# EasyEDA Pro project STC15W4K56S4_2025-01-08_21-36-35.eprj, schematic Schematic1
Board Name: Board1; Create Date: 2025-01-08; Page Name: P1; Project Name: STC15W4K56S4_2025-01-08_21-36-35; Schematic Name: Schematic1; Update Date: 2025-01-13; Company: 嘉立创EDA; Page Size: A3; Version: V1.0
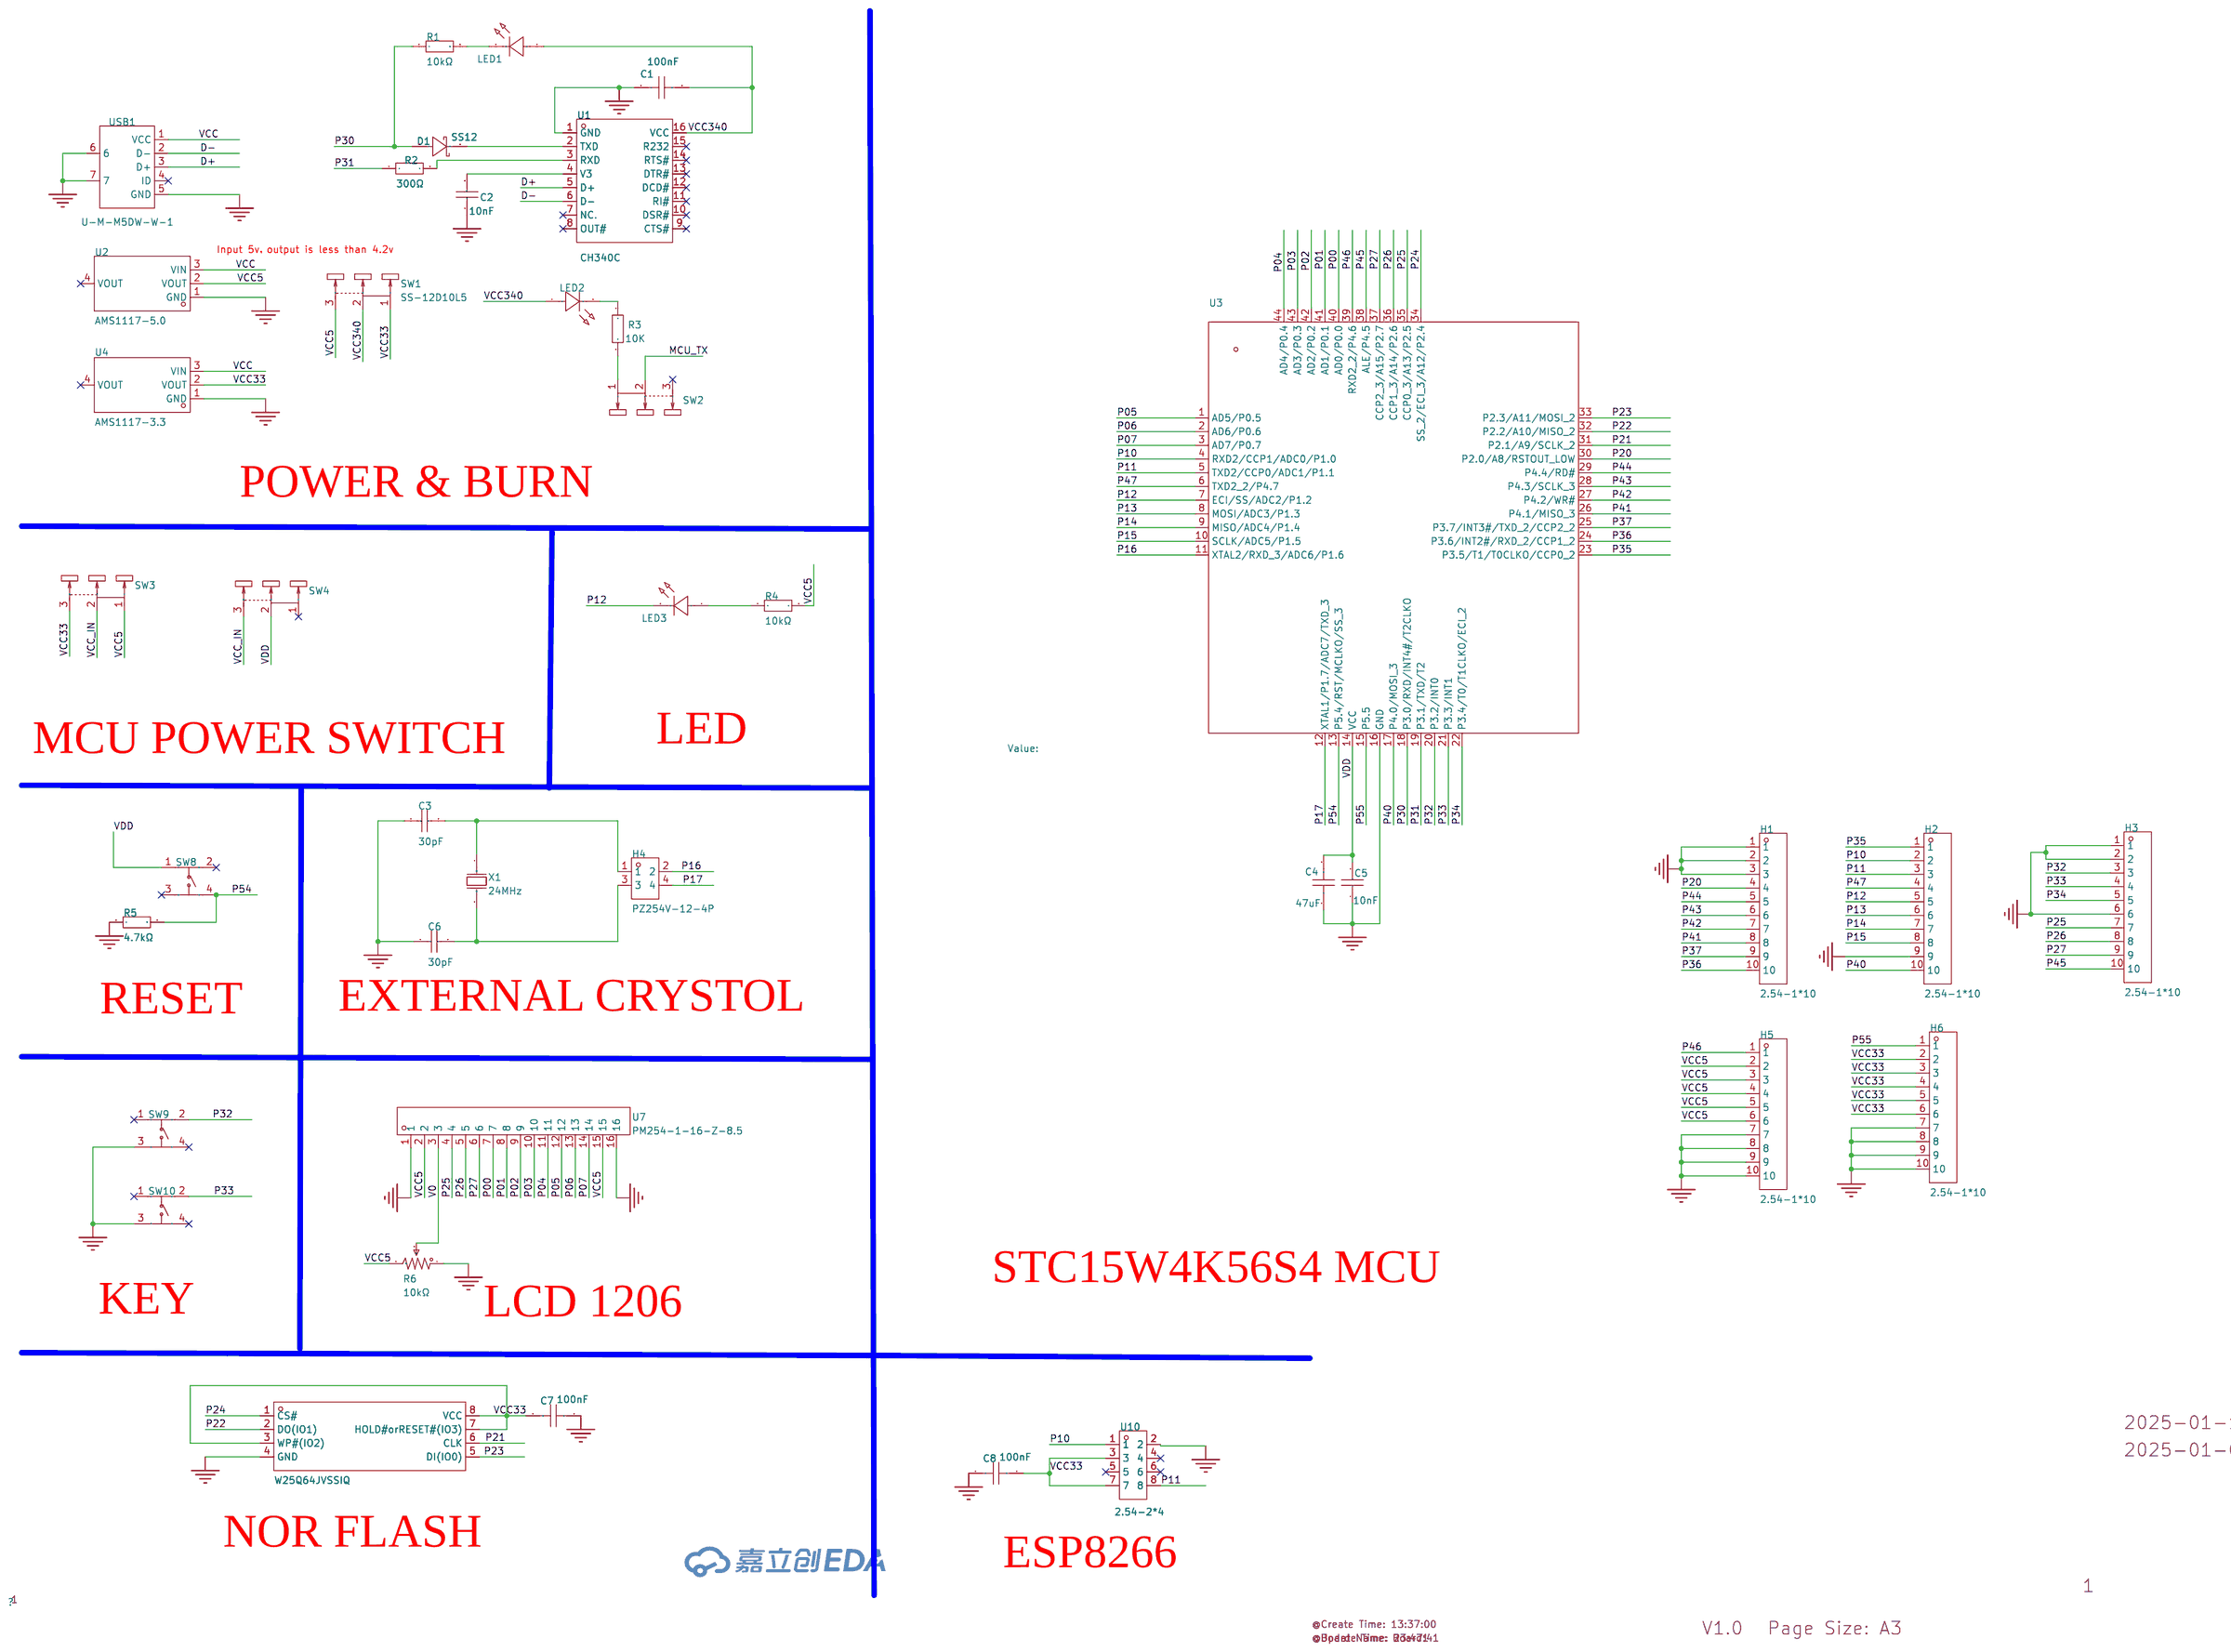
[diagram p0: schematic sheet]

## Parts
C1  100nF  [C0805]
C2  10nF  [C0805]
C3  30pF  [C0805]
C4  47uF  [C0805]
C5  10nF  [C0805]
C6  30pF  [C0805]
C7  100nF  [C0805]
C8  100nF  [C0805]
D1  SS12  [SMA_L4.3-W2.6-LS5.0-RD]
H1  2.54-1*10  [HDR-TH_10P-P2.54-V-M]
H2  2.54-1*10  [HDR-TH_10P-P2.54-V-M]
H3  2.54-1*10  [HDR-TH_10P-P2.54-V-M]
H4  PZ254V-12-4P  [HDR-TH_4P-P2.54-V-M-R2-C2-S2.54]
H5  2.54-1*10  [HDR-TH_10P-P2.54-V-M]
H6  2.54-1*10  [HDR-TH_10P-P2.54-V-M]
LED1  XL-3216SURC  [LED1206-R-RD_RED]
LED2  XL-3216SURC  [LED1206-R-RD_RED]
LED3  XL-3216SURC  [LED1206-R-RD_RED]
R1  10kΩ  [R0805]
R2  300Ω  [R0805]
R3  10K  [R0805]
R4  10kΩ  [R0805]
R5  4.7kΩ  [R0805]
R6  10kΩ  [RES-ADJ-TH_3P-L7.1-W6.9-P2.50-BL-BS]
SW1  SS-12D10L5  [SW-TH_SS-12D10L5]
SW2  SS-12D10L5  [SW-TH_SS-12D10L5]
SW3  SS-12D10L5  [SW-TH_SS-12D10L5]
SW4  SS-12D10L5  [SW-TH_SS-12D10L5]
SW8  KH-6X6X6H-STM  [SW-SMD_4P-L6.0-W6.0-P4.50-LS9.0-3]
SW9  KH-6X6X6H-STM  [SW-SMD_4P-L6.0-W6.0-P4.50-LS9.0-3]
SW10  KH-6X6X6H-STM  [SW-SMD_4P-L6.0-W6.0-P4.50-LS9.0-3]
U1  CH340C  [SOP-16_L10.0-W3.9-P1.27-LS6.0-BL]
U2  AMS1117-5.0  [SOT-223_L6.5-W3.5-P2.30-LS7.0-BR]
U3  STC15W4K56S4-30I-LQFP44  [LQFP-44_L10.0-W10.0-P0.80-LS12.0-BL]
U4  AMS1117-3.3  [SOT-223-3_L6.5-W3.4-P2.30-LS7.0-BR]
U7  PM254-1-16-Z-8.5  [HDR-TH_16P-P2.54-V-F-A]
U9  W25Q64JVSSIQ  [SOIC-8_L5.3-W5.3-P1.27-LS8.0-BL]
U10  2.54-2*4  [HDR-TH_8P-P2.54-V-F-R2-C4-S2.54]
USB1  U-M-M5DW-W-1  [MINI-USB-TH_U-M-M5DW-W-1]
X1  24MHz  [HC-49US_L11.5-W4.5-P4.88]

## Library data of the parts
C1 C7 C8 = CC0805KRX7R9BB104: LCSC Part Name: 100nF ±10% 50V; Supplier Part: C49678; Manufacturer: YAGEO(国巨); Supplier Footprint: 0805; JLCPCB Part Class: 基础库; Datasheet: https://atta.szlcsc.com/upload/public/pdf/source/20180224/C181747_15194369449651363981.pdf; Supplier: LCSC; Tolerance: ±10%; Voltage Rated: 50V; Temperature Coefficient: X7R
C2 C5 = CL21B103KBANNNC: LCSC Part Name: 10nF ±10% 50V; Supplier Part: C1710; Manufacturer: SAMSUNG(三星); Supplier Footprint: 0805; JLCPCB Part Class: 基础库; Datasheet: https://atta.szlcsc.com/upload/public/pdf/source/20160218/1457707763339.pdf; Supplier: LCSC; Tolerance: ±10%; Voltage Rated: 50V; Temperature Coefficient: X7R
C3 C6 = CC0805JRNPO9BN300: LCSC Part Name: 30pF ±5% 50V; Supplier Part: C107114; Manufacturer: YAGEO(国巨); Supplier Footprint: 0805; JLCPCB Part Class: 扩展库; Datasheet: https://atta.szlcsc.com/upload/public/pdf/source/20170914/C128857_1505359892143968080.pdf; Supplier: LCSC; Tolerance: ±5%; Voltage Rated: 50V; Temperature Coefficient: NP0
C4 = CGA0805X5R476M100MT: LCSC Part Name: 47uF ±20% 10V; Supplier Part: C6119904; Manufacturer: HRE(芯声); Supplier Footprint: 0805; JLCPCB Part Class: 扩展库; Supplier: LCSC; Tolerance: ±20%; Voltage Rated: 10V; Temperature Coefficient: X5R
D1 = SS12_C18199177: LCSC Part Name: 电压:20V 电流:1A; Supplier Part: C18199177; Manufacturer: 宏迦橙; Supplier Footprint: SMA(DO-214AC); JLCPCB Part Class: 扩展库; Datasheet: https://atta.szlcsc.com/upload/public/pdf/source/20230828/C73881E3299A0827586C2B1C18B17A53.pdf; Supplier: LCSC; Diode Configuration: 独立式; Forward Voltage (Vf@If): 550mV@1.0A; Reverse Voltage (Vr): 20V; Rectified Current: 1A; Reverse Leakage Current (Ir): 200uA@20V
H1-H3 H5 H6 = 2.54-1*10: Supplier Part: C5156617; Manufacturer: ZHOURI(洲日); Supplier Footprint: 插件,P=2.54mm; JLCPCB Part Class: 扩展库; Datasheet: https://atta.szlcsc.com/upload/public/pdf/source/20220915/6A37F92D15B6B0AD6F0538B20A260D3B.pdf; Supplier: LCSC; Pin Structure: 1x10P; Pitch: 2.54mm; Number of Rows: 单排; Number of Pins: 10P
H4 = PZ254V-12-4P: LCSC Part Name: 间距:2.54mm 2x2P 直插 方针; Supplier Part: C492419; Manufacturer: XFCN(兴飞); Supplier Footprint: 插件,P=2.54mm; JLCPCB Part Class: 扩展库; Datasheet: https://atta.szlcsc.com/upload/public/pdf/source/20200309/C492419_0001C06E73AFF21BD0ED3D7CEEF46D29.pdf; Supplier: LCSC; Pin Structure: 2x2P; Pitch: 2.54mm; Row Spacing: 2.54mm; Circluar Pins/Square Pins: 方针; Mounting Type: 直插; Number of Rows: 双排; Number of Pins: 4P; Length of Mating Pin: 6mm; Insulation Height: 2.5mm; Length of End Connection Pin: 3mm; Contact Material: 黄铜; Operating Temperature Range: -40℃~+105℃; Color: 黑色
LED1-LED3 = XL-3216SURC: Supplier Part: C965822; Manufacturer: XINGLIGHT(成兴光); Supplier Footprint: 1206; JLCPCB Part Class: 扩展库; Datasheet: https://atta.szlcsc.com/upload/public/pdf/source/20221102/38B682A5E5FDBBFCA7077B6272CE8E6F.pdf; Supplier: LCSC; Emitted Color: 红色; Power Dissipation: 55mW; Forward Current: 25mA; Dominant Wavelength: 617nm~621nm; Peak Wavelength: 623nm; Lens Color: 无色透明透镜; Viewing Angle: 120°; Mounting Sytle: 正贴; Operating Temperature: -30℃~+85℃
R1 R4 = 0805W8F1002T5E_C17414: LCSC Part Name: 10kΩ ±1% 125mW 厚膜电阻; Supplier Part: C17414; Manufacturer: UNI-ROYAL(厚声); Manufacturer Part: 0805W8F1002T5E; Supplier Footprint: 0805; JLCPCB Part Class: 基础库; Datasheet: https://atta.szlcsc.com/upload/public/pdf/source/20200306/C422600_1E6D84923E4A46A82E41ADD87F860B5C.pdf; Supplier: LCSC; Type: 厚膜电阻; Tolerance: ±1%; Power(Watts): 125mW; Overload Voltage (Max): 150V; Temperature Coefficient: ±100ppm/℃; Operating Temperature Range: -55℃~+155℃
R2 R3 = 0805W8F3000T5E: LCSC Part Name: 300Ω ±1% 125mW 厚膜电阻; Supplier Part: C17617; Manufacturer: UNI-ROYAL(厚声); Supplier Footprint: 0805; JLCPCB Part Class: 基础库; Datasheet: https://atta.szlcsc.com/upload/public/pdf/source/20200306/C422600_1E6D84923E4A46A82E41ADD87F860B5C.pdf; Supplier: LCSC; Type: 厚膜电阻; Tolerance: ±1%; Power(Watts): 125mW; Overload Voltage (Max): 150V; Temperature Coefficient: ±100ppm/℃; Operating Temperature Range: -55℃~+155℃
R5 = 0805W8F4701T5E: LCSC Part Name: 4.7kΩ ±1% 125mW 厚膜电阻; Supplier Part: C17673; Manufacturer: UNI-ROYAL(厚声); Supplier Footprint: 0805; JLCPCB Part Class: 基础库; Datasheet: https://atta.szlcsc.com/upload/public/pdf/source/20200306/C422600_1E6D84923E4A46A82E41ADD87F860B5C.pdf; Supplier: LCSC; Type: 厚膜电阻; Tolerance: ±1%; Power(Watts): 125mW; Overload Voltage (Max): 150V; Temperature Coefficient: ±100ppm/℃; Operating Temperature Range: -55℃~+155℃
R6 = 3362W-1-103LF: LCSC Part Name: 10kΩ ±10%; Supplier Part: C81167; Manufacturer: BOURNS; Supplier Footprint: 插件-3P,7x6.6mm; JLCPCB Part Class: 扩展库; Datasheet: https://atta.szlcsc.com/upload/public/pdf/source/20170914/C124756_1505374041527969003.pdf; Supplier: LCSC; Tolerance: ±10%; Power(Watts): 500mW; Temperature Coefficient: ±100ppm/℃; Turns: 1
SW1-SW4 = SS-12D10L5: LCSC Part Name: 柄长5mm 直插双档 滑动开关; Supplier Part: C319012; Manufacturer: XKB Connectivity(中国星坤); Supplier Footprint: 插件; JLCPCB Part Class: 扩展库; Datasheet: https://atta.szlcsc.com/upload/public/pdf/source/20211009/D6412F37AABE6F9459A6EE7FA4DAEADB.pdf; Supplier: LCSC; Circuit: 单刀双掷; Actuator Style: 矩形柱状; Pin Style: PC引脚; Switch Length: 13mm; Switch Width: 6.8mm; Switch Height: 6.4mm; Mounting Style: 直插; Actuator Color: 黑色; Current Rating (DC): 3A; Voltage Rating (DC): 125V; Current Rating (AC): 3A; Voltage Rating (AC): 125V; Mechanical Life: 1万次; Operating Temperature: -40℃~+85℃
SW8-SW10 = KH-6X6X6H-STM: LCSC Part Name: 6*6*6mm 立贴 轻触开关; Supplier Part: C2837532; Manufacturer: kinghelm(金航标); Supplier Footprint: SMD; JLCPCB Part Class: 扩展库; Datasheet: https://atta.szlcsc.com/upload/public/pdf/source/20210608/C2837532_E316B9464CED229D1EEC211AA57656A9.pdf; Supplier: LCSC; Circuit: 单刀单掷; Actuator Style: 圆形按钮; Mounting Style: 立贴; Switch Length: 6mm; Switch Width: 6mm; Switch Height: 6mm; Strike Gundam: 不带; Contact Current: 50mA; Voltage Rating (DC): 12V; Actuator/Cap Color: 黑色; Pin Style: 鸥翼型; Mechanical Life: 8万次
U1 = CH340C: LCSC Part Name: CH340C USB转串口芯片 CH340; Supplier Part: C84681; Manufacturer: WCH(南京沁恒); Supplier Footprint: SOP-16; JLCPCB Part Class: 扩展库; Datasheet: https://atta.szlcsc.com/upload/public/pdf/source/20240619/63986D8440D4E5267A77ACD891CC4DE3.pdf; Supplier: LCSC; Applications Function: 收发器; Protocol: USB 2.0; Supply Voltage: 3.3V；5V; Data Rate: 2Mbps
U2 = AMS1117-5.0_C6187: LCSC Part Name: 输入12V 输出5V 1A; Supplier Part: C6187; Manufacturer: AMS; Supplier Footprint: SOT-223; JLCPCB Part Class: 基础库; Datasheet: https://atta.szlcsc.com/upload/public/pdf/source/20230918/E4B716057EE82179D88E8A0894830D59.pdf; Supplier: LCSC; Output Type: 固定; Maximum Input Voltage: 12V; Output Voltage: 5V; MAX Output Current: 1A; Power Supply Rejection Ratio (PSRR): 68dB@(120Hz); Dropout Voltage: 1.3V@(1A); Output Polarity: 正极; Number of Outputs: 1
U3 = STC15W4K56S4-30I-LQFP44: Supplier Part: C86616; Manufacturer: STC(宏晶); Supplier Footprint: LQFP-44(10x10); JLCPCB Part Class: 扩展库; Datasheet: https://atta.szlcsc.com/upload/public/pdf/source/20210111/C86616_6B1BA3DD9B6F3889110A7FD00A512AE6.pdf; Supplier: LCSC; CPU Core: 51系列; Program Storage Size: 56KB; RAM Size: 4KB; GPIO Ports Number: 42; Operating Voltage Range: 2.5V~5.5V; Program Memory Type: FLASH; Operating Temperature Range: -40℃~+85℃; ADC (Bit): 10bit; PWM (Bit): 15bit; 16Bit Timer: 5; UART/USART: 4; SPI: 1; Internal Comparator: 有; Peripheral/Function: 低电压检测；看门狗；CCP捕获/比较; Watchdog: 有; Low-Voltage Detect: 有; CCP Capture/Compare: 有; Internal Oscillator: 有
U4 = AMS1117-3.3_C6186: LCSC Part Name: 输出3.3V 1A; Supplier Part: C6186; Manufacturer: AMS; Supplier Footprint: SOT-223; JLCPCB Part Class: 基础库; Datasheet: https://atta.szlcsc.com/upload/public/pdf/source/20180727/C6186_7A095716F0823C02F1997A905E26C086.pdf; Supplier: LCSC; Output Type: 固定; Output Voltage: 3.3V; MAX Output Current: 1A; Power Supply Rejection Ratio (PSRR): 72dB@(120Hz); Dropout Voltage: 1.3V@(800mA); Output Polarity: 正极; Number of Outputs: 1
U7 = PM254-1-16-Z-8.5: LCSC Part Name: 1x16P 间距:2.54mm 直插; Supplier Part: C2897379; Manufacturer: HCTL(华灿天禄); Supplier Footprint: 插件,P=2.54mm; JLCPCB Part Class: 扩展库; Datasheet: https://atta.szlcsc.com/upload/public/pdf/source/20230609/534BE42964C679BDE98E061007C4ABD6.pdf; Supplier: LCSC; Holes Structure: 1x16P; Pitch: 2.54mm; Circular Hole / Square Hole: 方孔; Mounting Type: 直插; Number of Rows: 单排; Number of Holes: 16P; Current Rating (Max): 3A; Holes Direction: 顶部; Insulation Height: 8.5mm; Contact Material: 铜合金; Operating Temperature Range: -40℃~+105℃; Soldering Temperature(Max): 260℃@5S
U9 = W25Q64JVSSIQ: Supplier Part: C179171; Manufacturer: WINBOND(华邦); Supplier Footprint: SOIC-8-208mil; JLCPCB Part Class: 扩展库; Datasheet: https://atta.szlcsc.com/upload/public/pdf/source/20191218/C179171_92C5C91D0324539EDD8F1160D2E79C0F.pdf; Supplier: LCSC
U10 = 2.54-2*4: LCSC Part Name: 间距:2.54mm 2x4P 直插; Supplier Part: C2977588; Manufacturer: ZHOURI(洲日); Supplier Footprint: 插件,P=2.54mm; JLCPCB Part Class: 扩展库; Datasheet: https://atta.szlcsc.com/upload/public/pdf/source/20220328/363EB391BC0EB759CF231FC910753CBE.pdf; Supplier: LCSC; Holes Structure: 2x4P; Pitch: 2.54mm; Row Spacing: 2.54mm; Circular Hole / Square Hole: 方孔; Mounting Type: 直插; Number of Rows: 双排; Number of Holes: 8P; Current Rating (Max): 2.5A; Holes Direction: 顶部; Insulation Height: 8.5mm; Operating Temperature Range: -40℃~+105℃
USB1 = U-M-M5DW-W-1: 连接器类型:Mini-B;标准:USB 2.0;公母:母;端口数量:1;触点数量:5P;安装方式:弯插;额定电流 - 电源:1A;工作温度范围:-;; LCSC Part Name: Mini-B 母 弯插; Supplier Part: C530648; Manufacturer: 韩国韩荣; Supplier Footprint: 插件; JLCPCB Part Class: 扩展库; Datasheet: https://atta.szlcsc.com/upload/public/pdf/source/20210810/4E75970C29AA25CC0A9C4F9798EF07C5.pdf; Supplier: LCSC; Connector Type: Mini-B; Standard: USB 2.0; Gender: 母; Number of Ports: 1; Number of Contacts: 5P; Mounting Style: 弯插; Current Rating - Power (Max): 1A
X1 = X49SD24MSD2SC: LCSC Part Name: 24MHz ±20ppm 20pF; Supplier Part: C2213; Manufacturer: YXC(扬兴晶振); Supplier Footprint: HC-49S; JLCPCB Part Class: 扩展库; Datasheet: https://atta.szlcsc.com/upload/public/pdf/source/20240329/977D7F2434F98B2BE33270BB9FF3D86D.pdf; Supplier: LCSC; Crystal Type: 直插晶振; Normal temperature Frequency Tolerance: ±20ppm; External load capacitor: 20pF; Frequency Stability(Full temperature range): ±30ppm; Operating Temperature: -20℃~+70℃

## Nets
GND: C1.1 C2.1 C3.1 C4.1 C5.1 C6.2 C7.2 C8.1 H1.1 H1.2 H1.3 H2.9 H3.1 H3.2 H3.6 H5.7 H5.8 H5.9 H5.10 H6.7 H6.8 H6.9 H6.10 R5.1 R6.1 SW9.3(C) SW10.3(C) U1.1(GND) U2.1(GND) U3.16(GND) U4.1(GND) U7.1 U7.16 U9.4(GND) U10.2 USB1.5(GND) USB1.6 USB1.7
V0: R6.2 U7.3
VCC: U2.3(VIN) U4.3(VIN) USB1.1(VCC)
VCC5: H5.2 H5.3 H5.4 H5.5 H5.6 R4.2 R6.3 SW1.3 SW3.1 U2.2(VOUT) U7.2 U7.15
VCC33: C7.1 C8.2 H6.2 H6.3 H6.4 H6.5 H6.6 SW1.1 SW3.3 U4.2(VOUT) U9.3(WP#(IO2)) U9.7(HOLD#orRESET#(IO3)) U9.8(VCC) U10.3 U10.7
VCC340: C1.2 LED1.1(K) LED2.1(K) SW1.2 U1.16(VCC)
VCC_IN: SW3.2 SW4.3
VDD: C4.2 C5.2 SW4.2 SW8.1(A) U3.14(VCC)
D+: U1.5(D+) USB1.3(D+)
D-: U1.6(D-) USB1.2(D-)
MCU_TX: SW2.2
P00: U3.40(AD0/P0.0) U7.7
P01: U3.41(AD1/P0.1) U7.8
P02: U3.42(AD2/P0.2) U7.9
P03: U3.43(AD3/P0.3) U7.10
P04: U3.44(AD4/P0.4) U7.11
P05: U3.1(AD5/P0.5) U7.12
P06: U3.2(AD6/P0.6) U7.13
P07: U3.3(AD7/P0.7) U7.14
P10: H2.2 U3.4(RXD2/CCP1/ADC0/P1.0) U10.1
P11: H2.3 U3.5(TXD2/CCP0/ADC1/P1.1) U10.8
P12: H2.5 LED3.2(A) U3.7(ECI/SS/ADC2/P1.2)
P13: H2.6 U3.8(MOSI/ADC3/P1.3)
P14: H2.7 U3.9(MISO/ADC4/P1.4)
P15: H2.8 U3.10(SCLK/ADC5/P1.5)
P16: H4.2 U3.11(XTAL2/RXD_3/ADC6/P1.6)
P17: H4.4 U3.12(XTAL1/P1.7/ADC7/TXD_3)
P20: H1.4 U3.30(P2.0/A8/RSTOUT_LOW)
P21: U3.31(P2.1/A9/SCLK_2) U9.6(CLK)
P22: U3.32(P2.2/A10/MISO_2) U9.2(DO(IO1))
P23: U3.33(P2.3/A11/MOSI_2) U9.5(DI(IO0))
P24: U3.34(SS_2/ECI_3/A12/P2.4) U9.1(CS#)
P25: H3.7 U3.35(CCP0_3/A13/P2.5) U7.4
P26: H3.8 U3.36(CCP1_3/A14/P2.6) U7.5
P27: H3.9 U3.37(CCP2_3/A15/P2.7) U7.6
P30: D1.2(A) R1.1 U3.18(P3.0/RXD/INT4#/T2CLKO)
P31: R2.1 U3.19(P3.1/TXD/T2)
P32: H3.3 SW9.2(B) U3.20(P3.2/INT0)
P33: H3.4 SW10.2(B) U3.21(P3.3/INT1)
P34: H3.5 U3.22(P3.4/T0/T1CLKO/ECI_2)
P35: H2.1 U3.23(P3.5/T1/T0CLKO/CCP0_2)
P36: H1.10 U3.24(P3.6/INT2#/RXD_2/CCP1_2)
P37: H1.9 U3.25(P3.7/INT3#/TXD_2/CCP2_2)
P40: H2.10 U3.17(P4.0/MOSI_3)
P41: H1.8 U3.26(P4.1/MISO_3)
P42: H1.7 U3.27(P4.2/WR#)
P43: H1.6 U3.28(P4.3/SCLK_3)
P44: H1.5 U3.29(P4.4/RD#)
P45: H3.10 U3.38(ALE/P4.5)
P46: H5.1 U3.39(RXD2_2/P4.6)
P47: H2.4 U3.6(TXD2_2/P4.7)
P54: R5.2 SW8.4(D) U3.13(P5.4/RST/MCLKO/SS_3)
P55: H6.1 U3.15(P5.5)
$1N627: D1.1(K) U1.2(TXD)
$1N631: R2.2 U1.3(RXD)
$1N635: C2.2 U1.4(V3)
$1N889: LED1.2(A) R1.2
$1N2603: LED2.2(A) R3.2
$1N2614: R3.1 SW2.1
$1N2745: C3.2 H4.1 X1.1(OSC1)
$1N2750: C6.1 H4.3 X1.2(OSC2)
$1N5908: LED3.1(K) R4.1

Not connected (* = marked no-connect by the designer): SW2 3*; SW4 1*; SW8 2(B)* 3(C)*; SW9 1(A)* 4(D)*; SW10 1(A)* 4(D)*; U1 7(NC.)* 8(OUT#)* 9(CTS#)* 10(DSR#)* 11(RI#)* 12(DCD#)* 13(DTR#)* 14(RTS#)* 15(R232)*; U2 4(VOUT)*; U4 4(VOUT)*; U10 4* 5* 6*; USB1 4(ID)*

## Notes on the sheet
- Input 5v，output is less than 4.2v
- POWER & BURN
- LED
- MCU POWER SWITCH
- RESET
- EXTERNAL CRYSTOL
- STC15W4K56S4 MCU
- KEY
- LCD 1206
- NOR FLASH
- ESP8266
